# EAGLE design octatrack-midi-foot-controller-v0.9 (EAGLE 7.2.0)
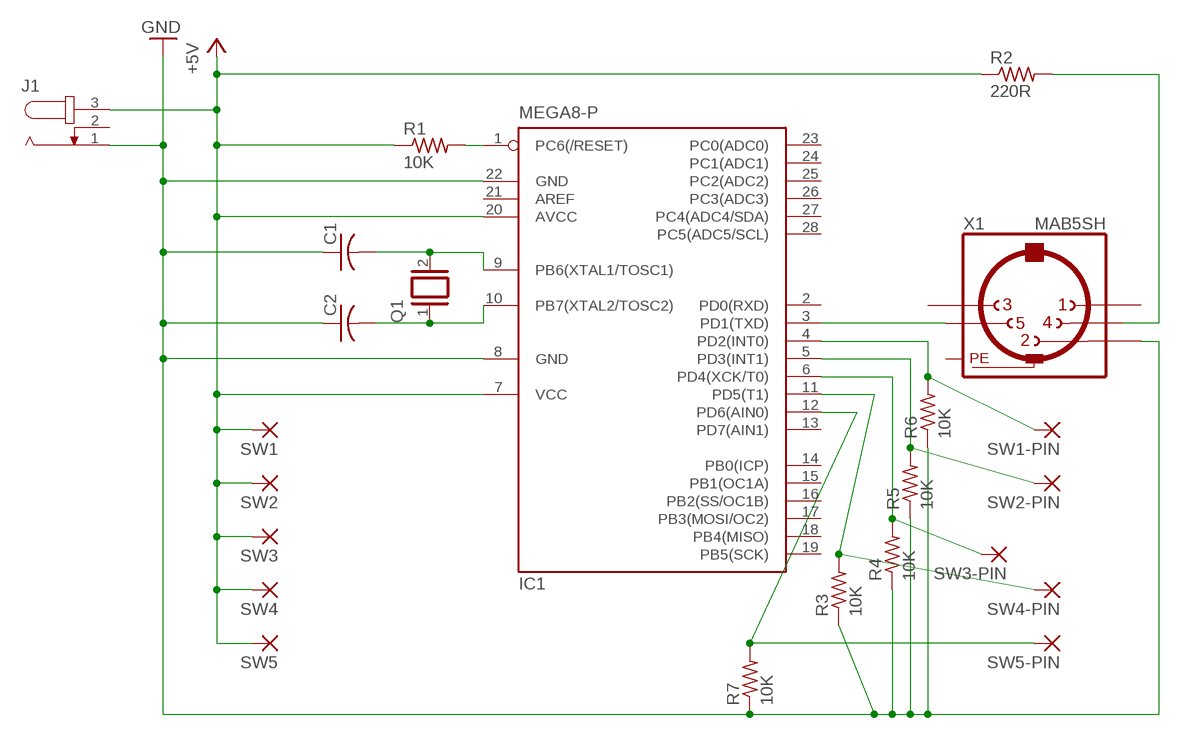
[diagram p0: schematic, sheet 1]

## Parts
C1  C-US025-025X050  [C025-025X050]
C2  C-US025-025X050  [C025-025X050]
IC1  MEGA8-P  [DIL28-3]
J1  JACK-PLUG0  [SPC4077]
Q1  XTAL  [Q]
R1  10K  R-US_0204/7  [0204/7]
R2  220R  R-US_0204/7  [0204/7]
R3  10K  R-US_0204/7  [0204/7]
R4  10K  R-US_0204/7  [0204/7]
R5  10K  R-US_0204/7  [0204/7]
R6  10K  R-US_0204/7  [0204/7]
R7  10K  R-US_0204/7  [0204/7]
SW1  WIREPAD3,17/1,1  [3,17/1,1]
SW1-PIN  WIREPAD3,17/1,1  [3,17/1,1]
SW2  WIREPAD3,17/1,1  [3,17/1,1]
SW2-PIN  WIREPAD3,17/1,1  [3,17/1,1]
SW3  WIREPAD3,17/1,1  [3,17/1,1]
SW3-PIN  WIREPAD3,17/1,1  [3,17/1,1]
SW4  WIREPAD3,17/1,1  [3,17/1,1]
SW4-PIN  WIREPAD3,17/1,1  [3,17/1,1]
SW5  WIREPAD3,17/1,1  [3,17/1,1]
SW5-PIN  WIREPAD3,17/1,1  [3,17/1,1]
X1  MAB5SH  [MAB5SH]

## Nets
+5V: IC1.7(VCC) IC1.20(AVCC) J1.3 R1.1 R2.1 SW1.1(P) SW2.1(P) SW3.1(P) SW4.1(P) SW5.1(P)
GND: C1.1 C2.1 IC1.8(GND) IC1.22(GND) J1.1 R3.1 R4.1 R5.1 R6.1 R7.1 X1.2
N$1: IC1.3(PD1(TXD)) X1.5
N$2: IC1.1(PC6(/RESET)) R1.2
N$3: R2.2 X1.4
N$4: IC1.4(PD2(INT0)) R6.2 SW1-PIN.1(P)
N$5: C1.2 IC1.9(PB6(XTAL1/TOSC1)) Q1.2
N$6: C2.2 IC1.10(PB7(XTAL2/TOSC2)) Q1.1
N$7: IC1.5(PD3(INT1)) R5.2 SW2-PIN.1(P)
N$8: IC1.6(PD4(XCK/T0)) R4.2 SW3-PIN.1(P)
N$9: IC1.11(PD5(T1)) R3.2 SW4-PIN.1(P)
N$10: IC1.12(PD6(AIN0)) R7.2 SW5-PIN.1(P)
Unconnected: IC1.2(PD0(RXD)) IC1.13(PD7(AIN1)) IC1.14(PB0(ICP)) IC1.15(PB1(OC1A)) IC1.16(PB2(SS/OC1B)) IC1.17(PB3(MOSI/OC2)) IC1.18(PB4(MISO)) IC1.19(PB5(SCK)) IC1.21(AREF) IC1.23(PC0(ADC0)) IC1.24(PC1(ADC1)) IC1.25(PC2(ADC2)) IC1.26(PC3(ADC3)) IC1.27(PC4(ADC4/SDA)) IC1.28(PC5(ADC5/SCL)) J1.2 X1.1 X1.3

## Power pins joined to a net without a drawn wire
PE: X1.PE X1.PE@(PE)

## Library data of the parts
C1 C2 = rcl:C-US: CAPACITOR, American symbol
IC1 = atmel:MEGA8-P: MICROCONTROLLER 8 Kbytes FLASH, 1 kbytes SRAM, 512 bytes EEPROM, USART, 4-channel 10 bit ADC, 2-channel 8 bit ADC Pin compatible with Atmega48, ATMega88, ATMega168 Source: avr.lbr; OC_FARNELL: unknown; OC_NEWARK: unknown
J1 = con-jack:JACK-PLUG: DC POWER JACK Power Jack, DC, Right Angle, Through Hole, Rated 5A at 16VDC, PC Terminals Distributor: Farnell (www.Farnell.de) Drawing: 84N1161.pdf / 84N1162.pdf Manufacturer: SPC Technology (www.spctechnology.com) Type: SPC4077 / SPC 4078; OC_FARNELL: unknown; OC_NEWARK: unknown
Q1 = special:XTAL: CRYSTAL
R1-R7 = rcl:R-US_: RESISTOR, American symbol
SW1 SW1-PIN SW2 SW2-PIN SW3 SW3-PIN SW4 SW4-PIN SW5 SW5-PIN = wirepad:WIREPAD: Wire PAD connect wire on PCB
X1 = con-hirschmann:MAB5SH: Female CONNECTOR 5 pins 90 deg. with shield, horizontal (DIN 41524); OC_FARNELL: 809883; OC_NEWARK: unknown

## Board
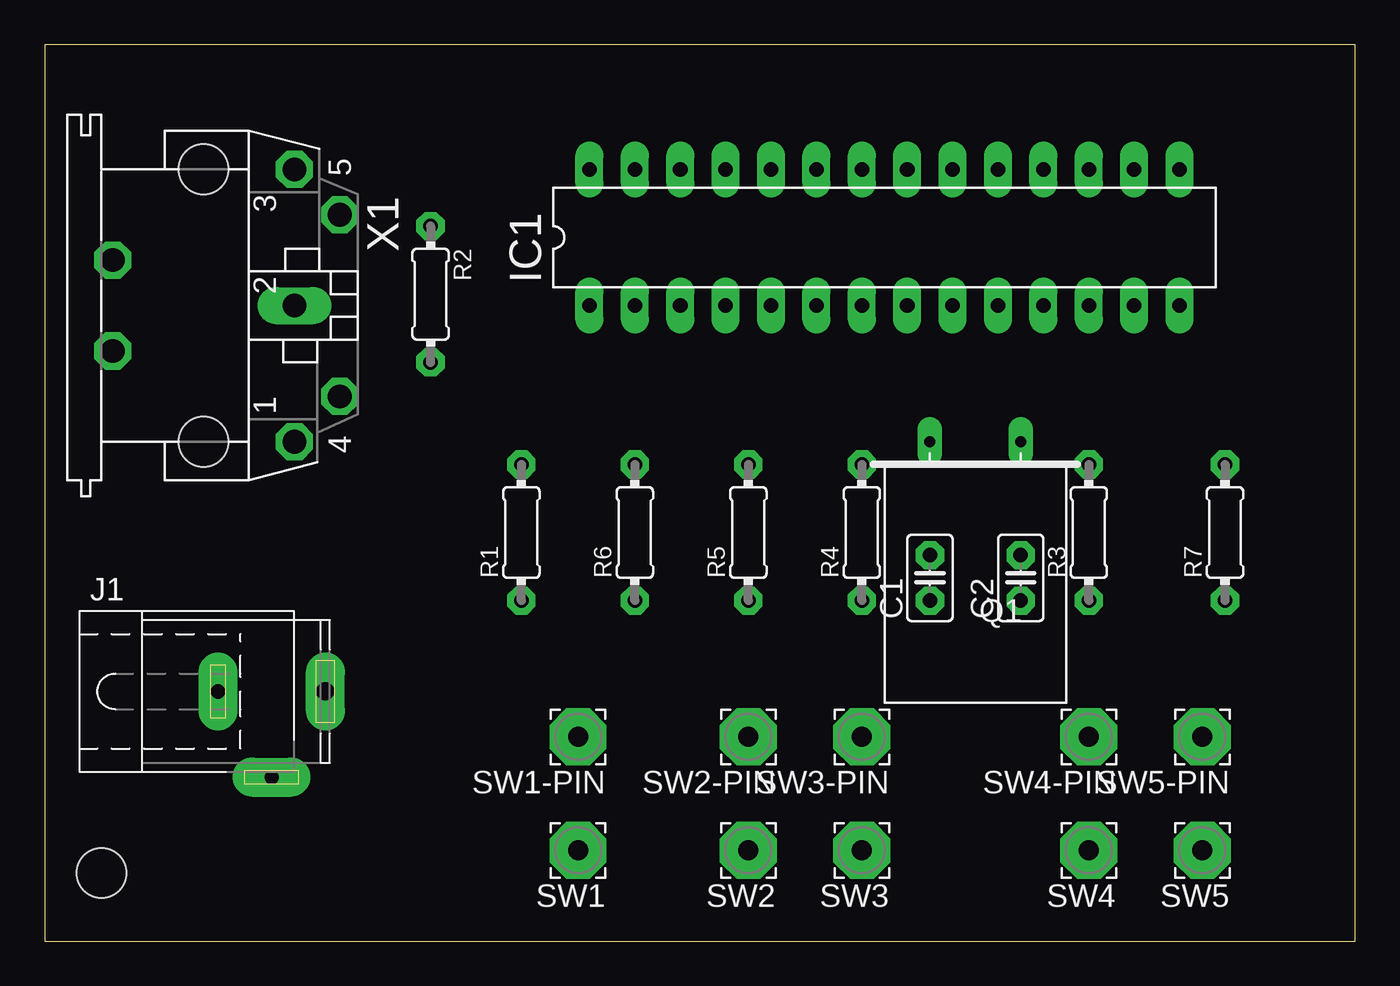
[diagram p1: board, top side]
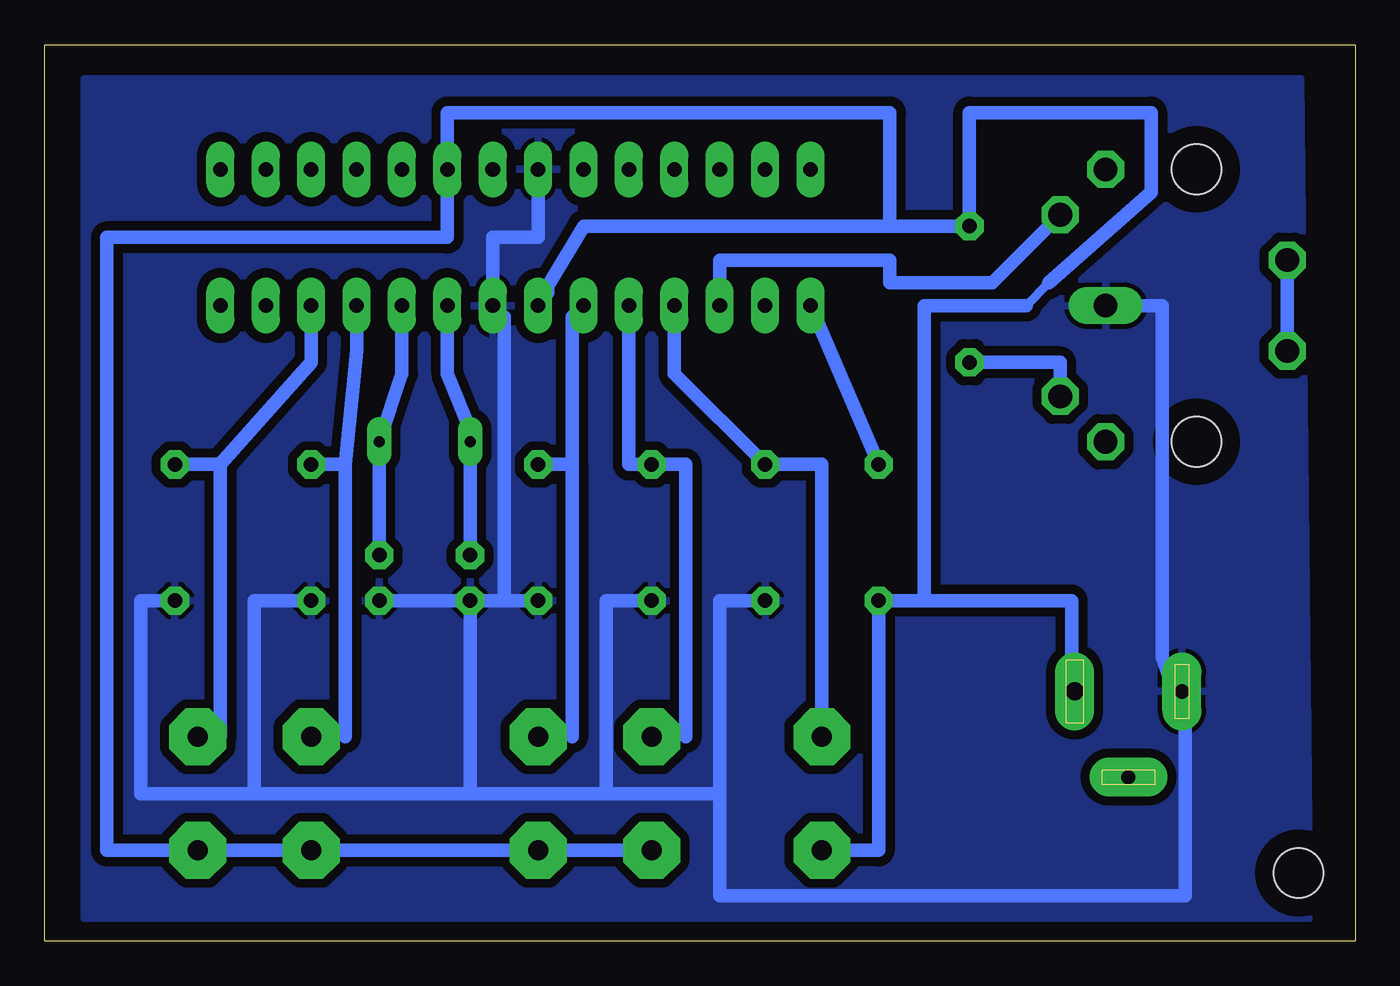
[diagram p2: board, bottom side, seen from below]

Size 73.33 x 50.16 mm. Coordinates in mm from the lower left corner, seen from the top.
Outline: 0,0 73.33,0 73.33,50.16 0,50.16 0,0
Copper layers (1*16): Top 0.035mm / dielectric 1.5mm / Bottom 0.035mm
Design rules "default *": minimum track width 20mil, minimum drill 24mil, track to track 20mil, track to pad 20mil, pad to pad 20mil, via to via 20mil, smd to smd 8mil, copper to edge 40mil, drill to drill 8mil, minimum pad ring 15mil, minimum via ring 8mil, stop-mask expansion 4mil, vias tented up to drill 0mil, thermal gap 10mil
Holes 2.8 mm at 3.17,3.81

### Footprints (pad centres in the part's own frame; a part is rotated, then mirrored left to right if it is on the bottom)
C025-025X050 = drill 0.813 octagon: 1 -1.27,0; 2 1.27,0
DIL28-3 = drill 0.813 long: 1 -16.51,-3.81; 2 -13.97,-3.81; 3 -11.43,-3.81; 4 -8.89,-3.81; 5 -6.35,-3.81; 6 -3.81,-3.81; 7 -1.27,-3.81; 8 1.27,-3.81; 9 3.81,-3.81; 10 6.35,-3.81; 11 8.89,-3.81; 12 11.43,-3.81; 13 13.97,-3.81; 14 16.51,-3.81; 15 16.51,3.81; 16 13.97,3.81; 17 11.43,3.81; 18 8.89,3.81; 19 6.35,3.81; 20 3.81,3.81; 21 1.27,3.81; 22 -1.27,3.81; 23 -3.81,3.81; 24 -6.35,3.81; 25 -8.89,3.81; 26 -11.43,3.81; 27 -13.97,3.81; 28 -16.51,3.81
SPC4077 = drill 0.8 pad 2.184 long: 1 -3,0; 2 0,-4.8 | drill 1 pad 2.184 long: 3 3,0
Q = drill 0.61 long: 1 -2.54,-7.62; 2 2.54,-7.62
0204/7 = drill 0.813 octagon: 1 -3.81,0; 2 3.81,0
3,17/1,1 = drill 1.118 pad 3.175 octagon: 1 0,0
MAB5SH = drill 1.321 octagon: 1 7.62,5.08; 3 -7.62,5.08; 4 5.08,7.62; 5 -5.08,7.62; PE -2.54,-5.08; PE@ 2.54,-5.08 | drill 1.321 long: 2 0,5.08 | hole 2.794: 7.62,0; -7.62,0

### Placement (x,y rotation side)
C1  49.53,20.32 90 top
C2  54.61,20.32 90 top
IC1  46.99,39.37 0 top
J1  12.7,13.97 0 top
Q1  52.07,20.32 180 top
R1  26.67,22.86 90 top
R2  21.59,36.2 270 top
R3  58.42,22.86 90 top
R4  45.72,22.86 90 top
R5  39.37,22.86 90 top
R6  33.02,22.86 90 top
R7  66.04,22.86 90 top
SW1  29.84,5.08 180 top
SW1-PIN  29.84,11.43 180 top
SW2  39.37,5.08 180 top
SW2-PIN  39.37,11.43 180 top
SW3  45.72,5.08 180 top
SW3-PIN  45.72,11.43 180 top
SW4  58.42,5.08 180 top
SW4-PIN  58.42,11.43 180 top
SW5  64.77,5.08 180 top
SW5-PIN  64.77,11.43 180 top
X1  8.89,35.56 270 top

### Tracks (layer width: path | path; a pad name or v marks a point on that pad's centre or on a via)
+5V
  Bottom 0.508: 15.88,13.97 J1.3 | IC1.7 45.09,36.2 45.09,36.83 | 17.14,36.83 18.41,35.56
  Bottom 0.762: 24.13,19.05 15.88,19.05 15.88,13.97 | 24.13,19.05 R1.1 26.67,5.08 SW1.1 | SW2.1 SW3.1 SW4.1 SW5.1 69.85,5.08 69.85,39.37 50.8,39.37 IC1.20 50.8,46.35 26.04,46.35 26.04,40.01 | 45.09,36.83 43.18,40.01 26.04,40.01 | 26.04,40.01 R2.1 21.59,46.35 11.43,46.35 11.43,41.91 17.14,36.83 | 24.13,19.05 24.13,35.56 18.41,35.56
GND
  Bottom 0.508: 10.16,13.97 J1.1 9.53,13.97 | 47.62,34.92 IC1.8
  Bottom 0.762: X1.2 10.79,35.56 10.79,15.88 10.16,13.97 | IC1.22 45.72,39.37 48.26,39.37 IC1.8 | R6.1 35.56,19.05 35.56,8.26 | 49.53,8.26 41.91,8.26 | 41.91,8.26 35.56,8.26 | C1.1 49.53,8.26 | R5.1 41.91,19.05 41.91,8.26 | C1.1 47.62,19.05 | 47.62,19.05 R4.1 | C1.1 C2.1 | R3.1 61.59,19.05 61.59,8.26 | 49.53,8.26 61.59,8.26 | R7.1 67.94,19.05 67.94,8.26 61.59,8.26 | 47.62,19.05 47.62,34.92 | 9.53,13.97 9.53,2.54 35.56,2.54 35.56,8.26
  pour Bottom (isolate 0.254): 71.12,48.26 3.05,48.26 2.54,1.27 71.12,1.27
N$1
  Bottom 0.762: IC1.3 35.56,38.1 26.04,38.1 26.04,36.83 20.32,36.83 X1.5
N$2
  Bottom 0.762: IC1.1 R1.2
N$3
  Bottom 0.762: R2.2 16.51,32.38 X1.4
N$4
  Bottom 0.762: IC1.4 38.1,31.75 R6.2 29.84,26.67 SW1-PIN.1
N$5
  Bottom 0.508: Q1.2 49.53,28.57
  Bottom 0.762: C1.2 Q1.2 | IC1.9 50.8,31.75 49.53,28.57
N$6
  Bottom 0.762: C2.2 Q1.1 53.34,31.75 IC1.10
N$7
  Bottom 0.508: 37.47,11.43 SW2-PIN.1
  Bottom 0.762: IC1.5 40.64,26.67 R5.2 37.47,26.67 37.47,11.43
N$8
  Bottom 0.508: 43.81,11.43 SW3-PIN.1
  Bottom 0.762: IC1.6 43.81,34.92 43.81,26.67 | R4.2 43.81,26.67 | 43.81,26.67 43.81,11.43
N$9
  Bottom 0.508: 56.52,11.43 SW4-PIN.1
  Bottom 0.762: 56.52,26.67 R3.2 | 56.52,26.67 55.88,33.02 IC1.11 | 56.52,26.67 56.52,11.43
N$10
  Bottom 0.762: IC1.12 58.42,32.38 63.5,26.67 | R7.2 63.5,26.67 | SW5-PIN.1 63.5,11.43 63.5,26.67
PE
  Bottom 0.762: X1.PE X1.PE@